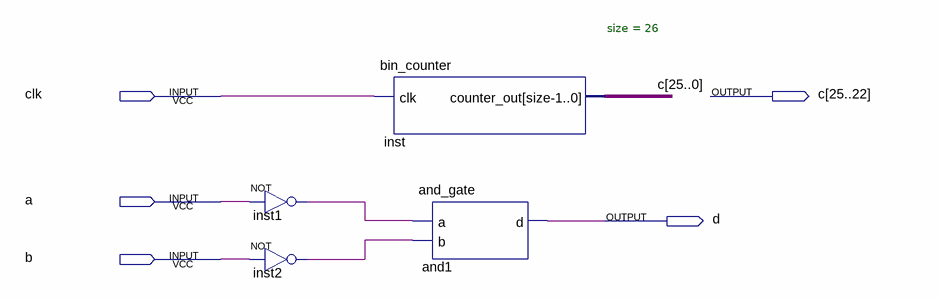
[diagram p0: schematic sheet]
// Quartus schematic top.bdf as structural Verilog: 4 symbols, 5 pins
module top (
  input  clk,
  input  a,
  input  b,
  output [25:0] c,
  output d
);

  wire inst1_out, inst2_out;

  not inst1 (inst1_out, a);
  not inst2 (inst2_out, b);
  bin_counter #(.size(26)) inst (.clk(clk), .counter_out(c));
  and_gate and1 (.a(inst1_out), .b(inst2_out), .d(d));
endmodule
